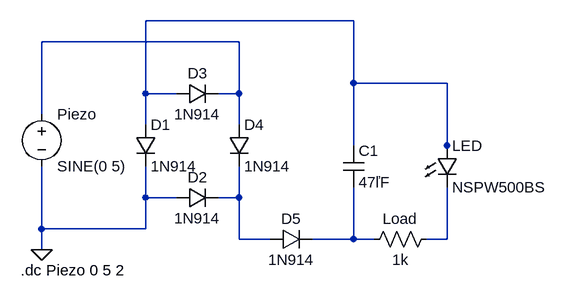
[diagram p0: schematic Simulation.asc]
Simulation.asc, the LTspice schematic file:
Version 4
SHEET 1 880 680
WIRE 400 -400 80 -400
WIRE 224 -368 -80 -368
WIRE 400 -304 400 -400
WIRE 544 -304 400 -304
WIRE 80 -288 80 -400
WIRE 128 -288 80 -288
WIRE 224 -288 224 -368
WIRE 224 -288 192 -288
WIRE -80 -256 -80 -368
WIRE 80 -240 80 -288
WIRE 224 -240 224 -288
WIRE 400 -208 400 -304
WIRE 544 -208 544 -304
WIRE 544 -192 544 -208
WIRE 80 -128 80 -176
WIRE 128 -128 80 -128
WIRE 224 -128 224 -176
WIRE 224 -128 192 -128
WIRE -80 -80 -80 -176
WIRE 80 -80 80 -128
WIRE 80 -80 -80 -80
WIRE 224 -64 224 -128
WIRE 272 -64 224 -64
WIRE 400 -64 400 -144
WIRE 400 -64 336 -64
WIRE 432 -64 400 -64
WIRE 544 -64 544 -144
WIRE 544 -64 512 -64
WIRE -80 -48 -80 -80
FLAG -80 -48 0
SYMBOL diode 64 -240 R0
SYMATTR InstName D1
SYMATTR Value 1N914
SYMBOL diode 128 -112 R270
WINDOW 0 32 32 VTop 2
WINDOW 3 0 32 VBottom 2
SYMATTR InstName D2
SYMATTR Value 1N914
SYMBOL diode 128 -272 R270
WINDOW 0 32 32 VTop 2
WINDOW 3 0 32 VBottom 2
SYMATTR InstName D3
SYMATTR Value 1N914
SYMBOL diode 208 -240 R0
SYMATTR InstName D4
SYMATTR Value 1N914
SYMBOL voltage -80 -272 R0
WINDOW 123 0 0 Left 0
WINDOW 39 0 0 Left 0
SYMATTR InstName Piezo
SYMATTR Value SINE(0 5)
SYMBOL diode 272 -48 R270
WINDOW 0 32 32 VTop 2
WINDOW 3 0 32 VBottom 2
SYMATTR InstName D5
SYMATTR Value 1N914
SYMBOL cap 384 -208 R0
SYMATTR InstName C1
SYMATTR Value 47ľF
SYMBOL LED 528 -208 R0
SYMATTR InstName LED
SYMATTR Value NSPW500BS
SYMBOL res 416 -48 R270
WINDOW 0 32 56 VTop 2
WINDOW 3 0 56 VBottom 2
SYMATTR InstName Load
SYMATTR Value 1k
TEXT -112 -16 Left 2 !.dc Piezo 0 5 2

The netlist it stands for:
* Simulation.asc
D1 N001 0 1N914
D2 0 N003 1N914
D3 N001 N002 1N914
D4 N002 N003 1N914
V§Piezo N002 0 SINE(0 5)
D5 N003 N004 1N914
C1 N001 N004 47ľF
D§LED N001 N005 NSPW500BS
R§Load N004 N005 1k
.model D D
.lib standard.dio
.dc Piezo 0 5 2
.backanno
.end